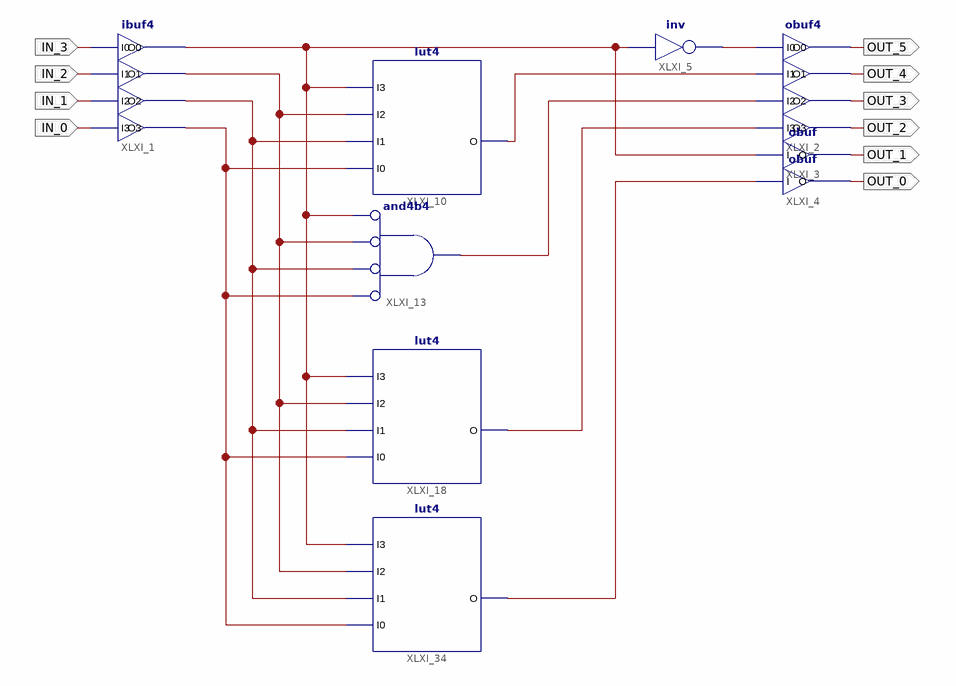
[diagram p0: schematic sheet 1]
// Xilinx ISE schematic Decoder4To6.sch (spartan3a) as structural Verilog: 9 symbols, 10 ports
module Decoder4To6 (
  input  IN_3,
  input  IN_2,
  input  IN_1,
  input  IN_0,
  output OUT_5,
  output OUT_4,
  output OUT_3,
  output OUT_2,
  output OUT_1,
  output OUT_0
);

  wire XLXN_11, XLXN_20, XLXN_22, XLXN_23, XLXN_24, XLXN_37, XLXN_54, XLXN_94, XLXN_99;

  lut4 #(.INIT("E804")) XLXI_10 (.I0(XLXN_24), .I1(XLXN_23), .I2(XLXN_22), .I3(XLXN_94), .O(XLXN_20));
  ibuf4 XLXI_1 (.I0(IN_3), .I1(IN_2), .I2(IN_1), .I3(IN_0), .O0(XLXN_94), .O1(XLXN_22), .O2(XLXN_23), .O3(XLXN_24));
  and XLXI_13 (XLXN_37, ~XLXN_24, ~XLXN_23, ~XLXN_22, ~XLXN_94);  // and4b4
  not XLXI_5 (XLXN_11, XLXN_94);
  lut4 #(.INIT("8002")) XLXI_18 (.I0(XLXN_24), .I1(XLXN_23), .I2(XLXN_22), .I3(XLXN_94), .O(XLXN_54));
  obuf4 XLXI_2 (.I0(XLXN_11), .I1(XLXN_20), .I2(XLXN_37), .I3(XLXN_54), .O0(OUT_5), .O1(OUT_4), .O2(OUT_3), .O3(OUT_2));
  obuf XLXI_4 (.I(XLXN_99), .O(OUT_0));
  obuf XLXI_3 (.I(XLXN_94), .O(OUT_1));
  lut4 #(.INIT("1C23")) XLXI_34 (.I0(XLXN_24), .I1(XLXN_23), .I2(XLXN_22), .I3(XLXN_94), .O(XLXN_99));
endmodule
